# EAGLE design Daughter_Board (EAGLE 8.4.0)
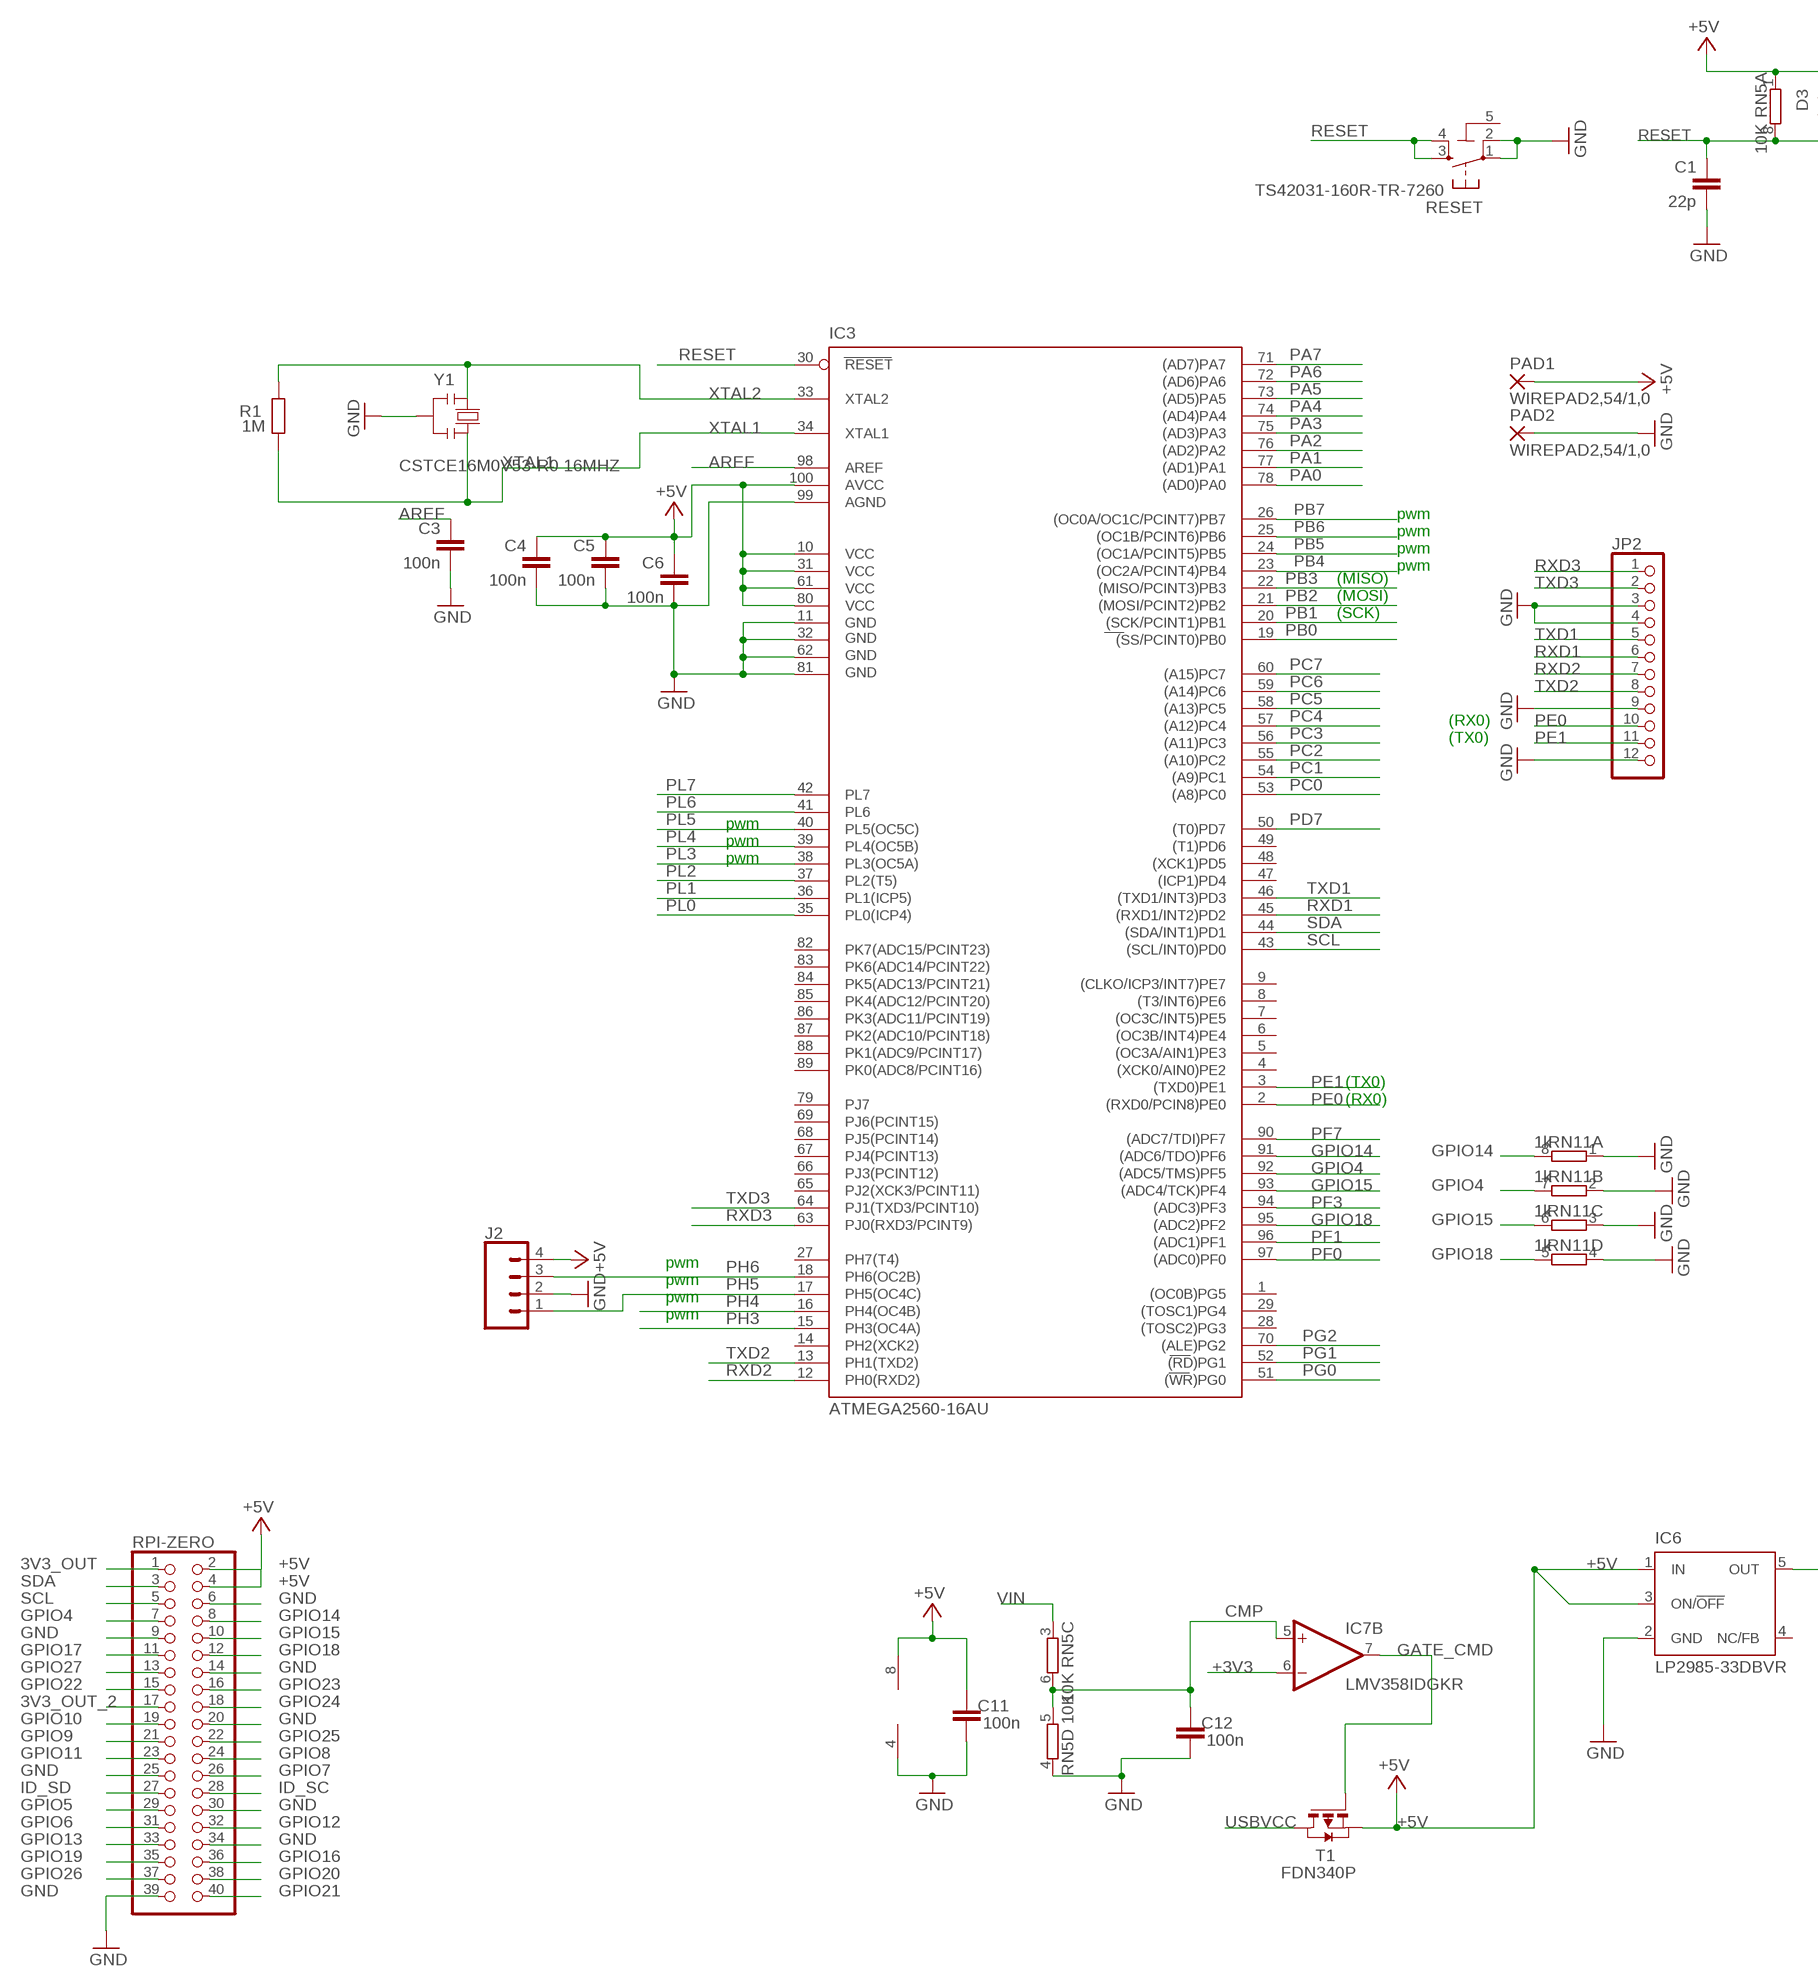
[diagram p0: schematic, sheet 1, part 1 of 2]
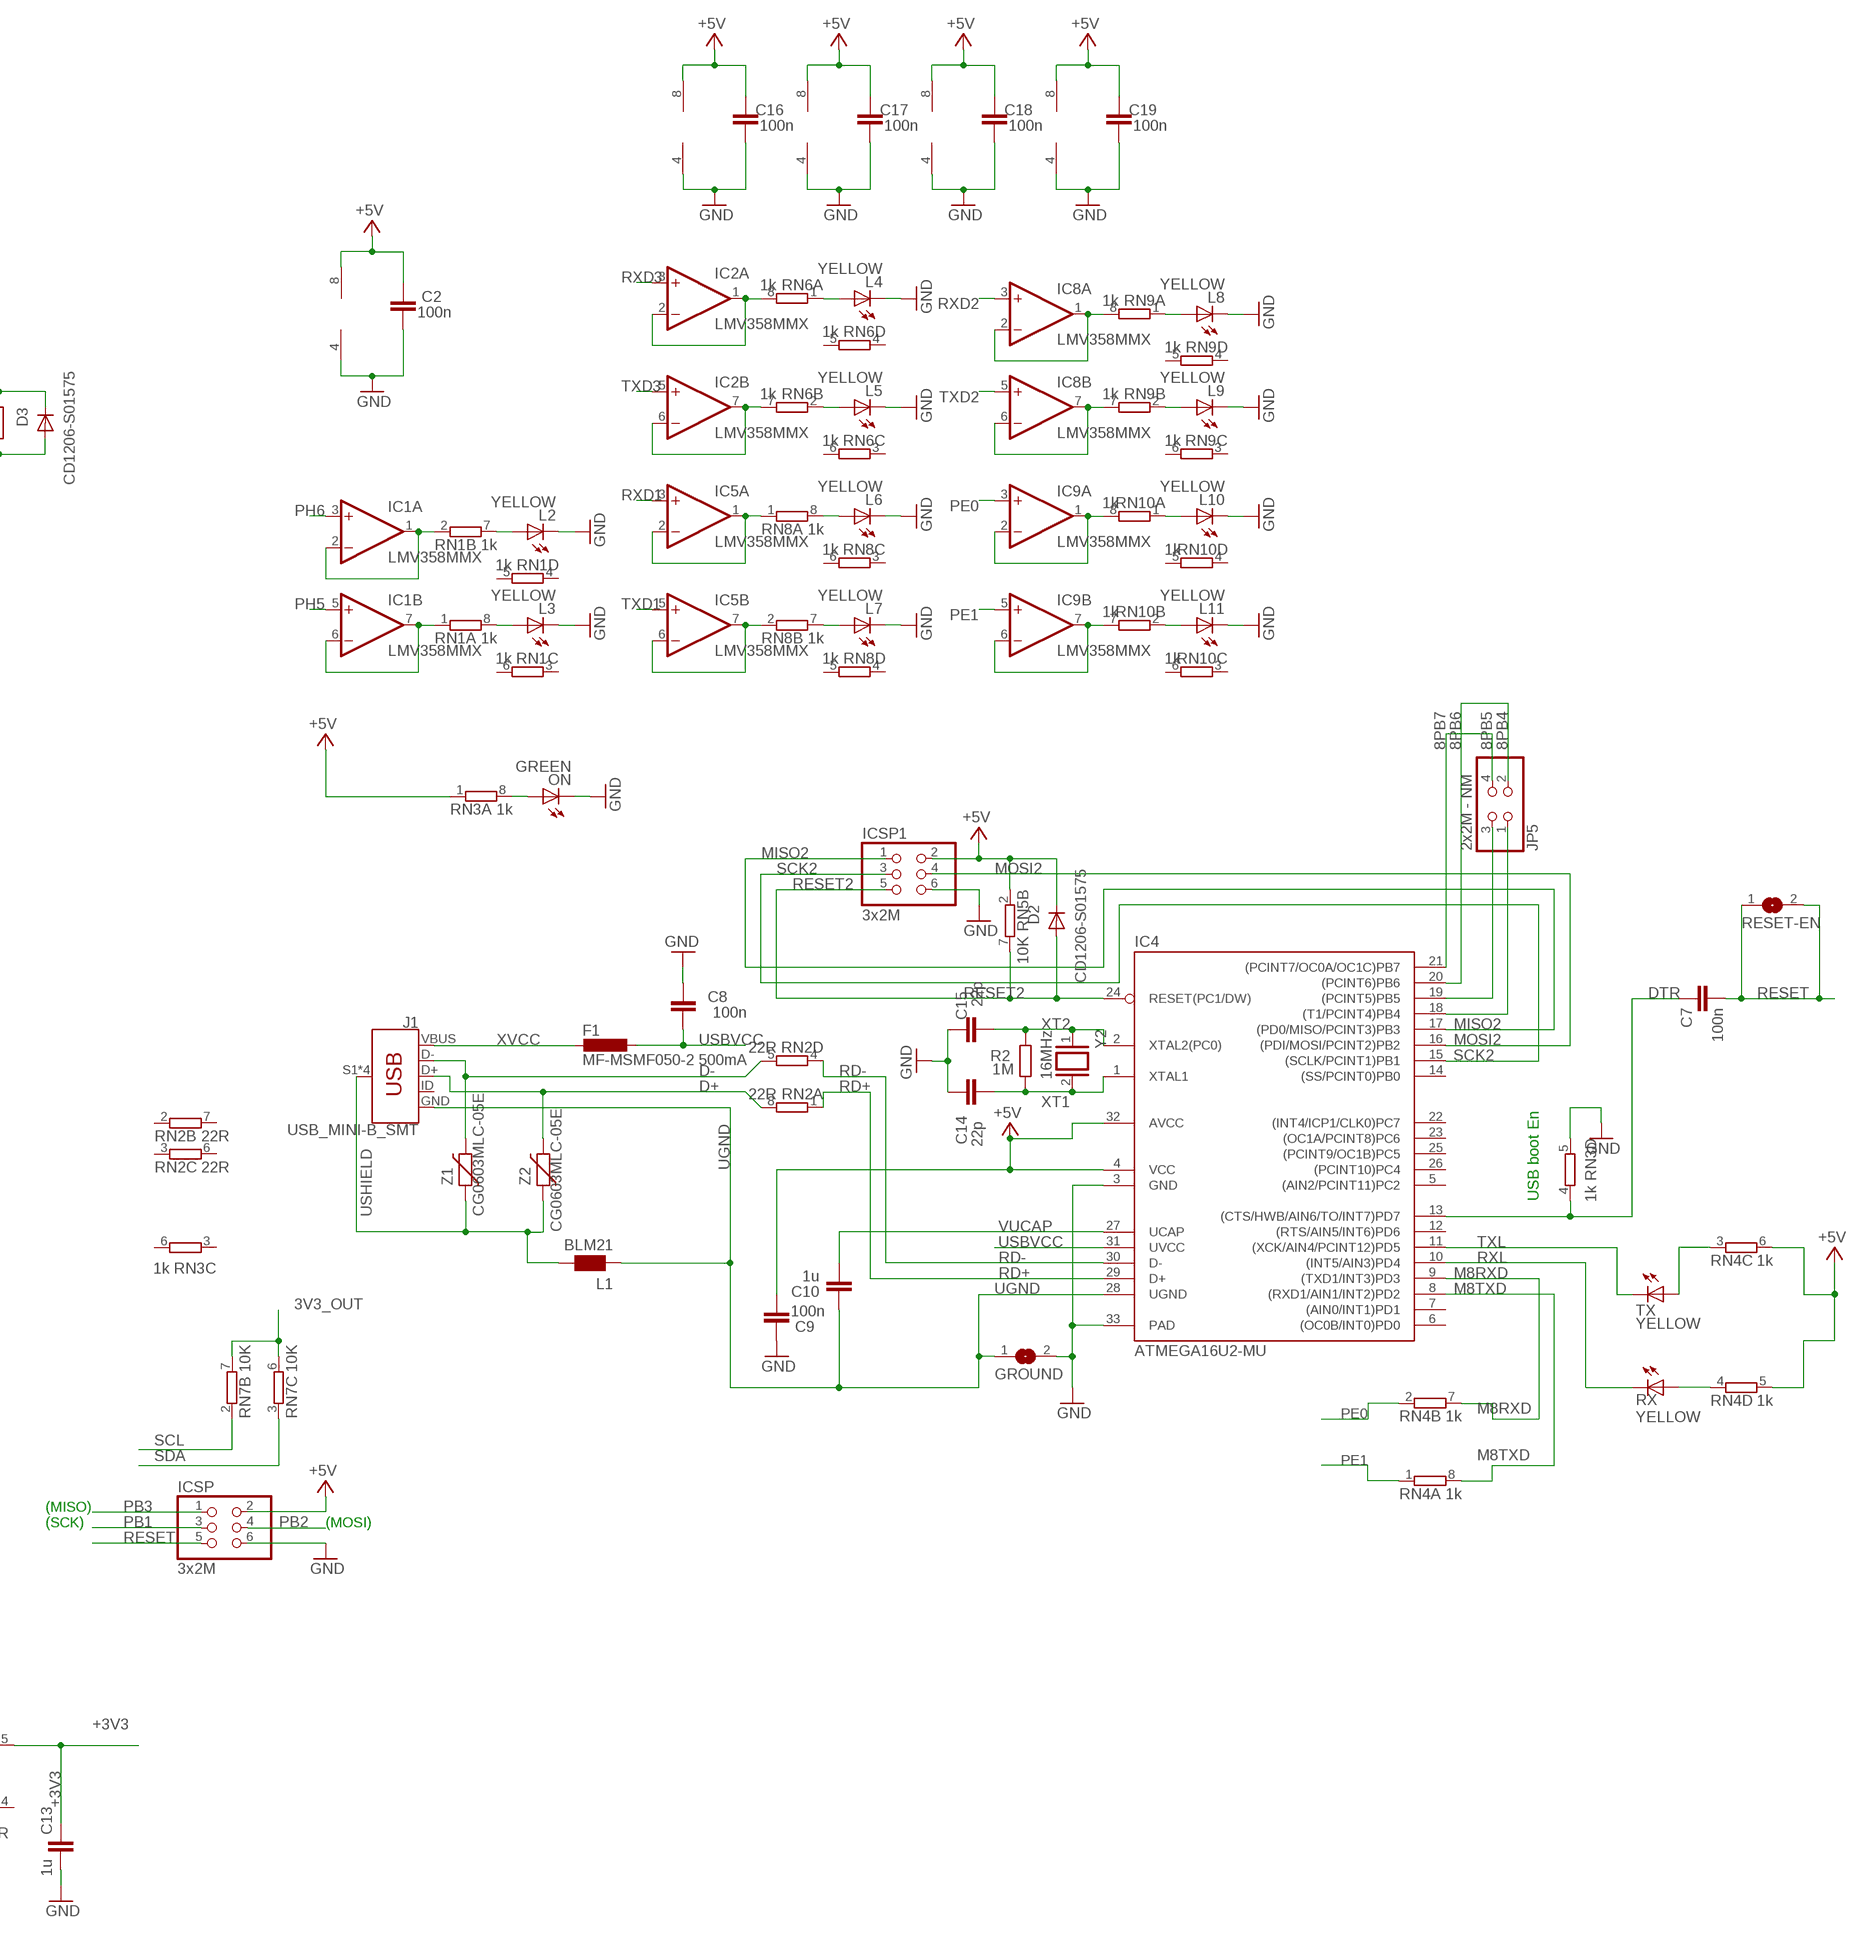
[diagram p1: schematic, sheet 1, part 2 of 2]

## Parts
C1  22p  C-EU0603-RND  [C0603-ROUND]
C2  100n  C-EU0603-RND  [C0603-ROUND]
C3  100n  C-EU0603-RND  [C0603-ROUND]
C4  100n  C-EU0603-RND  [C0603-ROUND]
C5  100n  C-EU0603-RND  [C0603-ROUND]
C6  100n  C-EU0603-RND  [C0603-ROUND]
C7  100n  C-EU0603-RND  [C0603-ROUND]
C8  100n  C-EU0603-RND  [C0603-ROUND]
C9  100n  C-EU0603-RND  [C0603-ROUND]
C10  1u  C-EU0603-RND  [C0603-ROUND]
C11  100n  C-EU0603-RND  [C0603-ROUND]
C12  100n  C-EU0603-RND  [C0603-ROUND]
C13  1u  C-EU0603-RND  [C0603-ROUND]
C14  22p  C-EU0603-RND  [C0603-ROUND]
C15  22p  C-EU0603-RND  [C0603-ROUND]
C16  100n  C-EU0603-RND  [C0603-ROUND]
C17  100n  C-EU0603-RND  [C0603-ROUND]
C18  100n  C-EU0603-RND  [C0603-ROUND]
C19  100n  C-EU0603-RND  [C0603-ROUND]
D2  CD1206-S01575  DIODE-MINIMELF  [MINIMELF]
D3  CD1206-S01575  DIODE-MINIMELF  [MINIMELF]
F1  MF-MSMF050-2 500mA  L-EUL1812  [L1812]
GROUND  SJ  [SJ]
IC1  LMV358MMX  [MSOP08]
IC2  LMV358MMX  [MSOP08]
IC3  ATMEGA2560-16AU  ATMEGA25602560-16AU  [TQFP100]
IC4  ATMEGA16U2-MU  [MLF32]
IC5  LMV358MMX  [MSOP08]
IC6  LP2985-33DBVR  LP2985-XXDBVR33  [SOT23-DBV]
IC7  LMV358IDGKR  LMV358MMX  [MSOP08]
IC8  LMV358MMX  [MSOP08]
IC9  LMV358MMX  [MSOP08]
ICSP  3x2M  PINHD-2X3  [2X03]
ICSP1  3x2M  PINHD-2X3  [2X03]
J1  USB_MINI-B_SMT  [USB-MINIB]
J2  CONN_04  [1X04]
JP2  PINHD-1X12-CB  [1X12-CB]
JP5  2x2M - NM  PINHD-2X2  [2X02]
L1  BLM21  WE-CBF_0805  [0805]
L2  YELLOW  LEDCHIP-LED0805  [CHIP-LED0805]
L3  YELLOW  LEDCHIP-LED0805  [CHIP-LED0805]
L4  YELLOW  LEDCHIP-LED0805  [CHIP-LED0805]
L5  YELLOW  LEDCHIP-LED0805  [CHIP-LED0805]
L6  YELLOW  LEDCHIP-LED0805  [CHIP-LED0805]
L7  YELLOW  LEDCHIP-LED0805  [CHIP-LED0805]
L8  YELLOW  LEDCHIP-LED0805  [CHIP-LED0805]
L9  YELLOW  LEDCHIP-LED0805  [CHIP-LED0805]
L10  YELLOW  LEDCHIP-LED0805  [CHIP-LED0805]
L11  YELLOW  LEDCHIP-LED0805  [CHIP-LED0805]
ON  GREEN  LEDCHIP-LED0805  [CHIP-LED0805]
PAD1  WIREPAD2,54/1,0  [2,54/1,0]
PAD2  WIREPAD2,54/1,0  [2,54/1,0]
R1  1M  R-EU_R0603  [R0603-ROUND]
R2  1M  R-EU_R0603  [R0603-ROUND]
RESET  TS42031-160R-TR-7260  TS42  [TS42]
RESET-EN  SJ  [SJ]
RN1  1k  4R-NCAY16  [CAY16]
RN2  22R  4R-NCAY16  [CAY16]
RN3  1k  4R-NCAY16  [CAY16]
RN4  1k  4R-NCAY16  [CAY16]
RN5  10K  4R-NCAT16  [CAT16]
RN6  1k  4R-NCAY16  [CAY16]
RN7  10K  4R-NCAT16  [CAT16]
RN8  1k  4R-NCAY16  [CAY16]
RN9  1k  4R-NCAY16  [CAY16]
RN10  1k  4R-NCAY16  [CAY16]
RN11  1k  4R-NCAY16  [CAY16]
RPI-ZERO  PINHD-2X20  [2X20]
RX  YELLOW  LEDCHIP-LED0805  [CHIP-LED0805]
T1  FDN340P  PMOSSOT23  [SOT-23]
TX  YELLOW  LEDCHIP-LED0805  [CHIP-LED0805]
Y1  CSTCE16M0V53-R0 16MHZ  RESONATORMU  [RESONATOR]
Y2  16MHz  XTAL/S  [QS]
Z1  CG0603MLC-05E  VARISTORCN0603  [CT/CN0603]
Z2  CG0603MLC-05E  VARISTORCN0603  [CT/CN0603]

## Nets
3V3_OUT: RN7.6 RN7.7 RPI-ZERO.1
3V3_OUT_2: RPI-ZERO.17
8PB4: IC4.18((T1/PCINT4)PB4) JP5.1
8PB5: IC4.19((PCINT5)PB5) JP5.3
8PB6: IC4.20((PCINT6)PB6) JP5.2
8PB7: IC4.21((PCINT7/OC0A/OC1C)PB7) JP5.4
+3V3 [power]: C13.2 IC6.5(OUT) IC7.6(B:-IN)
+5V [power usb]: C2.2 C4.1 C5.1 C6.1 C9.1 C11.2 C16.2 C17.2 C18.2 C19.2 D2.C D3.C IC1.8(P:V+) IC2.8(P:V+) IC3.10(VCC) IC3.31(VCC1) IC3.61(VCC2) IC3.80(VCC3) IC3.100(AVCC) IC4.4(VCC) IC4.32(AVCC) IC5.8(P:V+) IC6.1(IN) IC6.3(ON/!OFF) IC7.8(P:V+) IC8.8(P:V+) IC9.8(P:V+) ICSP1.2 ICSP.2 J2.4 PAD1.1(P) RN3.1 RN4.5 RN4.6 RN5.1 RN5.2 RPI-ZERO.2 RPI-ZERO.4 T1.2(S)
AREF: C3.1 IC3.98(AREF)
CMP: C12.2 IC7.5(B:+IN) RN5.5 RN5.6
D+: J1.D+ RN2.8 Z2.2
D-: J1.D- RN2.5 Z1.2
DTR: C7.1 IC4.13((CTS/HWB/AIN6/TO/INT7)PD7) RN3.4
GATE_CMD: IC7.7(B:OUT) T1.3(G)
GND: C1.2 C2.1 C3.2 C4.2 C5.2 C6.2 C8.2 C9.2 C11.1 C12.1 C13.1 C14.2 C15.2 C16.1 C17.1 C18.1 C19.1 GROUND.2 IC1.4(P:V-) IC2.4(P:V-) IC3.11(GND) IC3.32(GND1) IC3.62(GND2) IC3.81(GND3) IC3.99(AGND) IC4.3(GND) IC4.33(PAD) IC5.4(P:V-) IC6.2(GND) IC7.4(P:V-) IC8.4(P:V-) IC9.4(P:V-) ICSP1.6 ICSP.6 J2.2 JP2.3 JP2.4 JP2.9 JP2.12 L2.C L3.C L4.C L5.C L6.C L7.C L8.C L9.C L10.C L11.C ON.C PAD2.1(P) RESET.1 RESET.2 RN3.5 RN5.4 RN11.1 RN11.2 RN11.3 RN11.4 RPI-ZERO.6 RPI-ZERO.9 RPI-ZERO.14 RPI-ZERO.20 RPI-ZERO.25 RPI-ZERO.30 RPI-ZERO.34 RPI-ZERO.39 Y1.2
GPIO4: IC3.92((ADC5/TMS)PF5) RN11.7 RPI-ZERO.7
GPIO5: RPI-ZERO.29
GPIO6: RPI-ZERO.31
GPIO7: RPI-ZERO.26
GPIO8: RPI-ZERO.24
GPIO9: RPI-ZERO.21
GPIO10: RPI-ZERO.19
GPIO11: RPI-ZERO.23
GPIO12: RPI-ZERO.32
GPIO13: RPI-ZERO.33
GPIO14: IC3.91((ADC6/TDO)PF6) RN11.8 RPI-ZERO.8
GPIO15: IC3.93((ADC4/TCK)PF4) RN11.6 RPI-ZERO.10
GPIO16: RPI-ZERO.36
GPIO17: RPI-ZERO.11
GPIO18: IC3.95((ADC2)PF2) RN11.5 RPI-ZERO.12
GPIO19: RPI-ZERO.35
GPIO20: RPI-ZERO.38
GPIO21: RPI-ZERO.40
GPIO22: RPI-ZERO.15
GPIO23: RPI-ZERO.16
GPIO24: RPI-ZERO.18
GPIO25: RPI-ZERO.22
GPIO26: RPI-ZERO.37
GPIO27: RPI-ZERO.13
ID_SC: RPI-ZERO.28
ID_SD: RPI-ZERO.27
M8RXD: IC4.9((TXD1/INT3)PD3) RN4.7
M8TXD: IC4.8((RXD1/AIN1/INT2)PD2) RN4.8
MISO2: IC4.17((PD0/MISO/PCINT3)PB3) ICSP1.1
MOSI2: IC4.16((PDI/MOSI/PCINT2)PB2) ICSP1.4
N$1: L3.A RN1.8
N$2: L2.A RN1.7
N$3: ON.A RN3.8
N$4: IC1.1(A:OUT) IC1.2(A:-IN) RN1.2
N$5: IC5.6(B:-IN) IC5.7(B:OUT) RN8.2
N$6: IC1.6(B:-IN) IC1.7(B:OUT) RN1.1
N$7: IC5.1(A:OUT) IC5.2(A:-IN) RN8.1
N$8: IC2.6(B:-IN) IC2.7(B:OUT) RN6.7
N$9: IC2.1(A:OUT) IC2.2(A:-IN) RN6.8
N$10: L4.A RN6.1
N$11: L5.A RN6.2
N$12: IC8.1(A:OUT) IC8.2(A:-IN) RN9.8
N$13: L7.A RN8.7
N$14: L6.A RN8.8
N$15: IC8.6(B:-IN) IC8.7(B:OUT) RN9.7
N$16: IC9.1(A:OUT) IC9.2(A:-IN) RN10.8
N$17: IC9.6(B:-IN) IC9.7(B:OUT) RN10.7
N$18: L11.A RN10.2
N$19: L10.A RN10.1
N$21: L8.A RN9.1
N$22: L9.A RN9.2
N$54: RN4.4 RX.A
N$55: RN4.3 TX.A
PA0: IC3.78((AD0)PA0)
PA1: IC3.77((AD1)PA1)
PA2: IC3.76((AD2)PA2)
PA3: IC3.75((AD3)PA3)
PA4: IC3.74((AD4)PA4)
PA5: IC3.73((AD5)PA5)
PA6: IC3.72((AD6)PA6)
PA7: IC3.71((AD7)PA7)
PB0: IC3.19((SS/PCINT0)PB0)
PB1: IC3.20((SCK/PCINT1)PB1) ICSP.3
PB2: IC3.21((MOSI/PCINT2)PB2) ICSP.4
PB3: IC3.22((MISO/PCINT3)PB3) ICSP.1
PB4: IC3.23((OC2A/PCINT4)PB4)
PB5: IC3.24((OC1A/PCINT5)PB5)
PB6: IC3.25((OC1B/PCINT6)PB6)
PB7: IC3.26((OC0A/OC1C/PCINT7)PB7)
PC0: IC3.53((A8)PC0)
PC1: IC3.54((A9)PC1)
PC2: IC3.55((A10)PC2)
PC3: IC3.56((A11)PC3)
PC4: IC3.57((A12)PC4)
PC5: IC3.58((A13)PC5)
PC6: IC3.59((A14)PC6)
PC7: IC3.60((A15)PC7)
PD7: IC3.50((T0)PD7)
PE0: IC3.2((RXD0/PCIN8)PE0) IC9.3(A:+IN) JP2.10 RN4.2
PE1: IC3.3((TXD0)PE1) IC9.5(B:+IN) JP2.11 RN4.1
PF0: IC3.97((ADC0)PF0)
PF1: IC3.96((ADC1)PF1)
PF3: IC3.94((ADC3)PF3)
PF7: IC3.90((ADC7/TDI)PF7)
PG0: IC3.51((WR)PG0)
PG1: IC3.52((RD)PG1)
PG2: IC3.70((ALE)PG2)
PH3: IC3.15(PH3(OC4A))
PH4: IC3.16(PH4(OC4B))
PH5: IC1.5(B:+IN) IC3.17(PH5(OC4C)) J2.1
PH6: IC1.3(A:+IN) IC3.18(PH6(OC2B)) J2.3
PL0: IC3.35(PL0(ICP4))
PL1: IC3.36(PL1(ICP5))
PL2: IC3.37(PL2(T5))
PL3: IC3.38(PL3(OC5A))
PL4: IC3.39(PL4(OC5B))
PL5: IC3.40(PL5(OC5C))
PL6: IC3.41(PL6)
PL7: IC3.42(PL7)
RD+: IC4.29(D+) RN2.1
RD-: IC4.30(D-) RN2.4
RESET: C1.1 C7.2 D3.A IC3.30(RESET) ICSP.5 RESET-EN.1 RESET-EN.2 RESET.3 RESET.4 RN5.8
RESET2: D2.A IC4.24(RESET(PC1/DW)) ICSP1.5 RN5.7
RXD1: IC3.45((RXD1/INT2)PD2) IC5.3(A:+IN) JP2.6
RXD2: IC3.12(PH0(RXD2)) IC8.3(A:+IN) JP2.7
RXD3: IC2.3(A:+IN) IC3.63(PJ0(RXD3/PCINT9)) JP2.1
RXL: IC4.10((INT5/AIN3)PD4) RX.C
SCK2: IC4.15((SCLK/PCINT1)PB1) ICSP1.3
SCL: IC3.43((SCL/INT0)PD0) RN7.2 RPI-ZERO.5
SDA: IC3.44((SDA/INT1)PD1) RN7.3 RPI-ZERO.3
TXD1: IC3.46((TXD1/INT3)PD3) IC5.5(B:+IN) JP2.5
TXD2: IC3.13(PH1(TXD2)) IC8.5(B:+IN) JP2.8
TXD3: IC2.5(B:+IN) IC3.64(PJ1(TXD3/PCINT10)) JP2.2
TXL: IC4.11((XCK/AIN4/PCINT12)PD5) TX.C
UGND [gnd]: C10.2 GROUND.1 IC4.28(UGND) J1.GND L1.1
USBVCC [power usb]: C8.1 F1.1 IC4.31(UVCC) T1.1(D)
USHIELD [gnd]: J1.S1(SHIELD) J1.S2(SHIELD) J1.S3(SHIELD) J1.S4(SHIELD) L1.2 Z1.1 Z2.1
VIN [power]: RN5.3
VUCAP: C10.1 IC4.27(UCAP)
XT1: C14.1 IC4.1(XTAL1) R2.1 Y2.2
XT2: C15.1 IC4.2(XTAL2(PC0)) R2.2 Y2.1
XTAL1: IC3.34(XTAL1) R1.1 Y1.3
XTAL2: IC3.33(XTAL2) R1.2 Y1.1
XVCC [power usb]: F1.2 J1.VBUS
Unconnected: IC3.1((OC0B)PG5) IC3.4((XCK0/AIN0)PE2) IC3.5((OC3A/AIN1)PE3) IC3.6((OC3B/INT4)PE4) IC3.7((OC3C/INT5)PE5) IC3.8((T3/INT6)PE6) IC3.9((CLKO/ICP3/INT7)PE7) IC3.14(PH2(XCK2)) IC3.27(PH7(T4)) IC3.28((TOSC2)PG3) IC3.29((TOSC1)PG4) IC3.47((ICP1)PD4) IC3.48((XCK1)PD5) IC3.49((T1)PD6) IC3.65(PJ2(XCK3/PCINT11)) IC3.66(PJ3(PCINT12)) IC3.67(PJ4(PCINT13)) IC3.68(PJ5(PCINT14)) IC3.69(PJ6(PCINT15)) IC3.79(PJ7) IC3.82(PK7(ADC15/PCINT23)) IC3.83(PK6(ADC14/PCINT22)) IC3.84(PK5(ADC13/PCINT21)) IC3.85(PK4(ADC12/PCINT20)) IC3.86(PK3(ADC11/PCINT19)) IC3.87(PK2(ADC10/PCINT18)) IC3.88(PK1(ADC9/PCINT17)) IC3.89(PK0(ADC8/PCINT16)) IC4.5((AIN2/PCINT11)PC2) IC4.6((OC0B/INT0)PD0) IC4.7((AIN0/INT1)PD1) IC4.12((RTS/AIN5/INT6)PD6) IC4.14((SS/PCINT0)PB0) IC4.22((INT4/ICP1/CLK0)PC7) IC4.23((OC1A/PCINT8)PC6) IC4.25((PCINT9/OC1B)PC5) IC4.26((PCINT10)PC4) IC6.4(NC/FB) IC7.1(A:OUT) IC7.2(A:-IN) IC7.3(A:+IN) J1.ID RN1.3 RN1.4 RN1.5 RN1.6 RN2.2 RN2.3 RN2.6 RN2.7 RN3.2 RN3.3 RN3.6 RN3.7 RN6.3 RN6.4 RN6.5 RN6.6 RN7.1 RN7.4 RN7.5 RN7.8 RN8.3 RN8.4 RN8.5 RN8.6 RN9.3 RN9.4 RN9.5 RN9.6 RN10.3 RN10.4 RN10.5 RN10.6

## Notes on the sheet
- pwm
- pwm
- pwm
- pwm
- (MISO)
- (MOSI)
- (SCK)
- (RX0)
- (TX0)
- pwm
- pwm
- pwm
- USB boot En
- (TX0)
- (RX0)
- pwm
- pwm
- pwm
- (MISO)
- pwm
- (SCK) | (MOSI)

## Power pins joined to a net without a drawn wire
5-GND: RESET.5(5-GND)

## Library data of the parts
C1-C19 = SmartPrj:C-EU: CAPACITOR, European symbol
D2 D3 = diode:DIODE-: DIODE
F1 = rcl:L-EU: INDUCTOR, European symbol
GROUND RESET-EN = jumper:SJ: SMD solder JUMPER
IC1 IC2 IC5 IC7-IC9 = linear:LMV358?*: Dual General Purpose, Low Voltage, Rail-to-Rail Output Operational Amplifiers Source: http://www.national.com/mpf/LM/LMV321.html http://www.national.com/dt/lmv_qual.pdf
IC3 = SmartPrj:ATMEGA2560: MICROCONTROLLER 64/128/256 Kbytes FLASH 4 Kbytes EEPROM 8 Kbytes SRAM 86 General Purpose I/O pins 12-channels16-bit PWM 4 x Serial USARTs 16-channels 10-bit A/D
IC4 = SmartPrj:ATMEGA16U2-
IC6 = SmartPrj:LP2985-XXDBVR: ULTRALOW-POWER 50-mA LOW-DROPOUT LINEAR REGULATORS 50-mA Low-Dropout Regulator Source: http://focus.ti.com/lit/ds/symlink/tps77001.pdf
ICSP ICSP1 = SmartPrj:PINHD-2X3: PIN HEADER
J1 = SparkFun-Connectors:USB_MINI-B: USB type Mini-B Connector Breaks out 5th pin, and includes shield pins if needed. SparkFun Products: SparkFun FTDI Basic Breakout <https://www.sparkfun.com/products/9716> SparkFun XBee Explorer USB <https://www.sparkfun.com/products/11812> SparkFun Redboard <https://www.sparkfun.com/products/12757>; PROD_ID: CONN-08193; SF_ID: PRT-00587
J2 = SparkFun-Connectors:CONN_04: Multi connection point. Often used as Generic Header-pin footprint for 0.1 inch spaced/style header connections On any of the 0.1 inch spaced packages, you can populate with these: Break Away Headers - Straight <https://www.sparkfun.com/products/116> (PRT-00116) Break Away Male Headers - Right Angle <https://www.sparkfun.com/products/553> (PRT-00553) Female Headers <https://www.sparkfun.com/products/115> (PRT-00115) Break Away Headers - Machine Pin <https://www.sparkfun.com/products/117> (PRT-00117) Break Away Female Headers - Swiss Machine Pin <https://www.sparkfun.com/products/743> (PRT-00743) For SCREWTERMINALS and SPRING TERMINALS visit here: Screw Terimnals on SparkFun.com <https://www.sparkfun.com/search/results?term=Screw+Terminals> (5mm/3.5mm/2.54mm spacing) This device is also useful as a general connection point to wire up your design to another part of your project. Our various solder wires solder well into these plated through hole pads. Hook-Up Wire - Assortment (Stranded, 22 AWG) <https://www.sparkfun.com/products/11375> (PRT-11375) Hook-Up Wire - Assortment (Solid Core, 22 AWG) <https://www.sparkfun.com/products/11367> (PRT-11367) View the entire wire category on our website here <https://www.sparkfun.com/categories/141> Special notes: Molex polarized connector foot print use with SKU : PRT-08231 with associated crimp pins and housings. 1MM SMD Version SKU: PRT-10208; PROD_ID: CONN-09696
JP2 = adafruit:PINHD-1X12: PIN HEADER
JP5 = SmartPrj:PINHD-2X2: PIN HEADER
L1 = wuerth-elektronik:WE-CBF: SMD EMI Suppression Ferrite Beads - excellent anti-EMI properties - low DCR - impedances till 3000 ohms - rated current up to 6 A
L2-L11 ON RX TX = led:LED: LED OSRAM: - CHIPLED LG R971, LG N971, LY N971, LG Q971, LY Q971, LO R971, LY R971 LH N974, LH R974 LS Q976, LO Q976, LY Q976 LO Q996 - Hyper CHIPLED LW Q18S LB Q993, LB Q99A, LB R99A - SideLED LS A670, LO A670, LY A670, LG A670, LP A670 LB A673, LV A673, LT A673, LW A673 LH A674 LY A675 LS A676, LA A676, LO A676, LY A676, LW A676 LS A679, LY A679, LG A679 - Hyper Micro SIDELED® LS Y876, LA Y876, LO Y876, LY Y876 LT Y87S - SmartLED LW L88C, LW L88S LB L89C, LB L89S, LG L890 LS L89K, LO L89K, LY L89K LS L896, LA L896, LO L896, LY L896 - TOPLED LS T670, LO T670, LY T670, LG T670, LP T670 LSG T670, LSP T670, LSY T670, LOP T670, LYG T670 LG T671, LOG T671, LSG T671 LB T673, LV T673, LT T673, LW T673 LH T674 LS T676, LA T676, LO T676, LY T676, LB T676, LH T676, LSB T676, LW T676 LB T67C, LV T67C, LT T67C, LS T67K, LO T67K, LY T67K, LW E67C LS E67B, LA E67B, LO E67B, LY E67B, LB E67C, LV E67C, LT E67C LW T67C LS T679, LY T679, LG T679 LS T770, LO T770, LY T770, LG T770, LP T770 LB T773, LV T773, LT T773, LW T773 LH T774 LS E675, LA E675, LY E675, LS T675 LS T776, LA T776, LO T776, LY T776, LB T776 LHGB T686 LT T68C, LB T68C - Hyper Mini TOPLED® LB M676 - Mini TOPLED Santana® LG M470 LS M47K, LO M47K, LY M47K Source: http://www.osram.convergy.de LUXEON: - LUMILED® LXK2-PW12-R00, LXK2-PW12-S00, LXK2-PW14-U00, LXK2-PW14-V00 LXK2-PM12-R00, LXK2-PM12-S00, LXK2-PM14-U00 LXK2-PE12-Q00, LXK2-PE12-R00, LXK2-PE12-S00, LXK2-PE14-T00, LXK2-PE14-U00 LXK2-PB12-K00, LXK2-PB12-L00, LXK2-PB12-M00, LXK2-PB14-N00, LXK2-PB14-P00, LXK2-PB14-Q00 LXK2-PR12-L00, LXK2-PR12-M00, LXK2-PR14-Q00, LXK2-PR14-R00 LXK2-PD12-Q00, LXK2-PD12-R00, LXK2-PD12-S00 LXK2-PH12-R00, LXK2-PH12-S00 LXK2-PL12-P00, LXK2-PL12-Q00, LXK2-PL12-R00 Source: www.luxeon.com KINGBRIGHT: KA-3528ASYC Source: www.kingbright.com
PAD1 PAD2 = wirepad:WIREPAD: Wire PAD connect wire on PCB
R1 R2 = SmartPrj:R-EU_: RESISTOR, European symbol
RESET = SmartPrj:TS42: TS42 Dongnan Electronics Tact switch VDC 12V - 50mA
RN1-RN11 = resistor-dil:4R-N: Array Chip Resistor Source: RS Component / Phycomp
RPI-ZERO = pinhead:PINHD-2X20: PIN HEADER
T1 = zetex:PMOSSOT23: MOS FET
Y1 = SmartPrj:RESONATOR
Y2 = SmartPrj:XTAL/S: CRYSTAL
Z1 Z2 = varistor:VARISTOR: VARISTOR

## Net classes
0 default: width 0.203 mm, drill 0.406 mm, clearance 0.203 mm
1 power: width 0.61 mm, drill 0.406 mm, clearance 0.203 mm
2 gnd: width 0.305 mm, drill 0.406 mm, clearance 0.203 mm
3 power usb: width 0.508 mm, drill 0.406 mm, clearance 0.203 mm

## Board
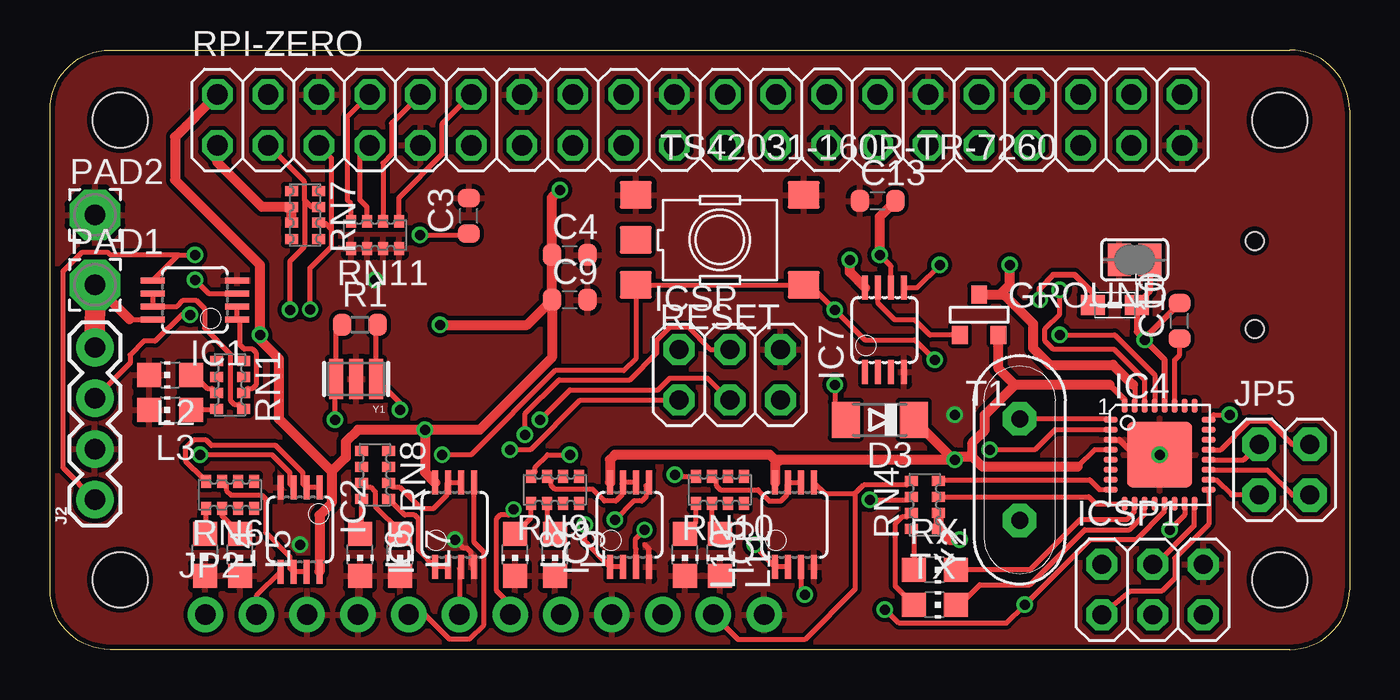
[diagram p2: board, top side]
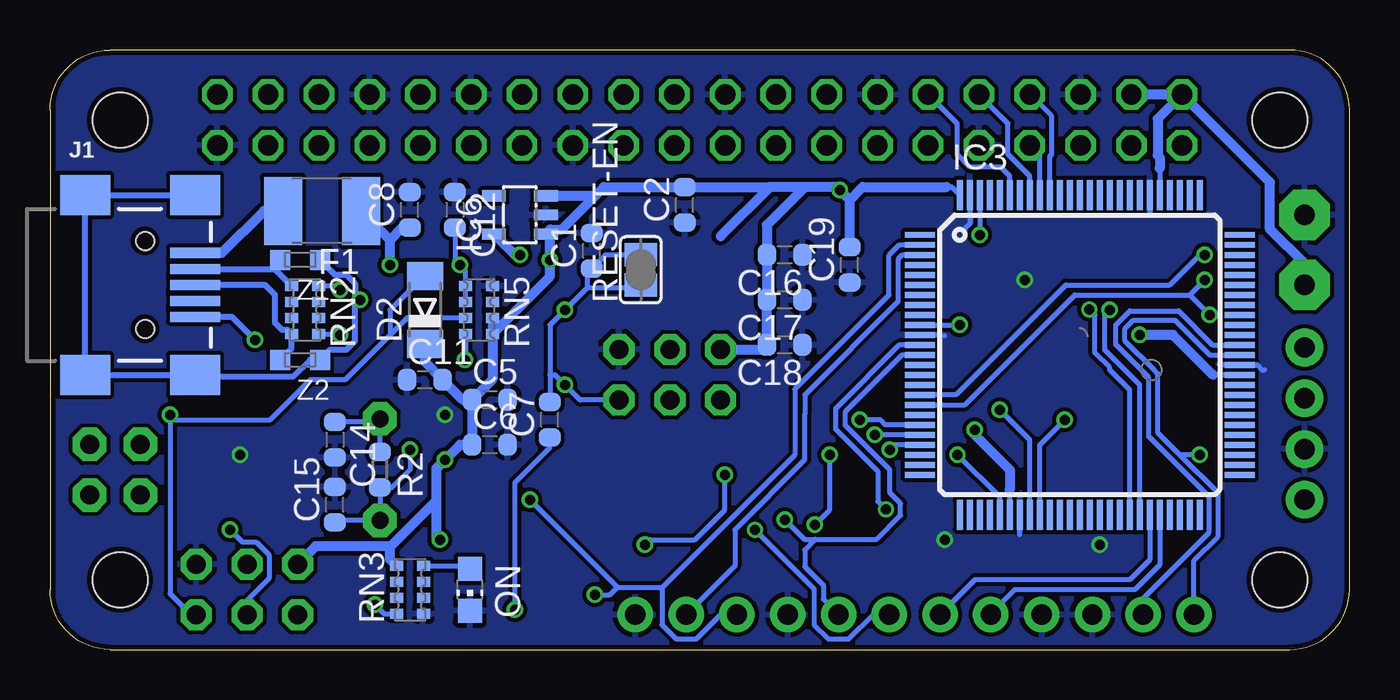
[diagram p3: board, bottom side, seen from below]

Size 65 x 30 mm. Coordinates in mm from the lower left corner, seen from the top.
Outline: 0,3 0,27 arc-90 3,30 62,30 arc-90 65,27 65,3 arc-90 62,0 3,0 arc-90 0,3
Copper layers (1*16): Top 0.035mm / dielectric 1.5mm / Bottom 0.035mm
Design rules "SeeedStudio_2layer_DRU_no_angle_20140221": minimum track width 6mil, minimum drill 12mil, track to track 6mil, track to pad 6mil, pad to pad 6mil, via to via 6mil, smd to smd 0mil, copper to edge 10mil, drill to drill 10mil, minimum pad ring 10mil, minimum via ring 6mil, stop-mask expansion 2mil, vias tented up to drill 100mil, thermal gap 10mil
Holes 2.75 mm at 3.5,3.5 3.5,26.5 61.5,26.5 61.5,3.5
tKeepout: area 0.8,23.8 to 6.2,29.2; area 0.8,0.8 to 6.2,6.2; area 58.8,0.8 to 64.2,6.2; area 58.8,23.8 to 64.2,29.2
bKeepout: area 0.8,23.8 to 6.2,29.2; area 0.8,0.8 to 6.2,6.2; area 58.8,0.8 to 64.2,6.2; area 58.8,23.8 to 64.2,29.2

### Footprints (pad centres in the part's own frame; a part is rotated, then mirrored left to right if it is on the bottom)
C0603-ROUND = smd 0.898 x 1.1: 1 -0.889,0; 2 0.889,0
MINIMELF = smd 1.4 x 1.8: A 1.7,0; C -1.7,0
L1812 = smd 1.9 x 3.4: 1 -1.95,0; 2 1.95,0
SJ = smd 1.168 x 1.6: 1 -0.762,0; 2 0.762,0
MSOP08 = smd 0.3 x 1.2: 1 -0.976,-2.113; 2 -0.326,-2.113; 3 0.324,-2.113; 4 0.974,-2.113; 5 0.974,2.112; 6 0.324,2.112; 7 -0.326,2.112; 8 -0.976,2.112
TQFP100 = smd 1.5 x 0.3: 1 -8,6; 2 -8,5.5; 3 -8,5; 4 -8,4.5; 5 -8,4; 6 -8,3.5; 7 -8,3; 8 -8,2.5; 9 -8,2; 10 -8,1.5; 11 -8,1; 12 -8,0.5; 13 -8,0; 14 -8,-0.5; 15 -8,-1; 16 -8,-1.5; 17 -8,-2; 18 -8,-2.5; 19 -8,-3; 20 -8,-3.5; 21 -8,-4; 22 -8,-4.5; 23 -8,-5; 24 -8,-5.5; 25 -8,-6; 51 8,-6; 52 8,-5.5; 53 8,-5; 54 8,-4.5; 55 8,-4; 56 8,-3.5; 57 8,-3; 58 8,-2.5; 59 8,-2; 60 8,-1.5; 61 8,-1; 62 8,-0.5; 63 8,0; 64 8,0.5; 65 8,1; 66 8,1.5; 67 8,2; 68 8,2.5; 69 8,3; 70 8,3.5; 71 8,4; 72 8,4.5; 73 8,5; 74 8,5.5; 75 8,6 | smd 0.3 x 1.5: 26 -6,-8; 27 -5.5,-8; 28 -5,-8; 29 -4.5,-8; 30 -4,-8; 31 -3.5,-8; 32 -3,-8; 33 -2.5,-8; 34 -2,-8; 35 -1.5,-8; 36 -1,-8; 37 -0.5,-8; 38 0,-8; 39 0.5,-8; 40 1,-8; 41 1.5,-8; 42 2,-8; 43 2.5,-8; 44 3,-8; 45 3.5,-8; 46 4,-8; 47 4.5,-8; 48 5,-8; 49 5.5,-8; 50 6,-8; 76 6,8; 77 5.5,8; 78 5,8; 79 4.5,8; 80 4,8; 81 3.5,8; 82 3,8; 83 2.5,8; 84 2,8; 85 1.5,8; 86 1,8; 87 0.5,8; 88 0,8; 89 -0.5,8; 90 -1,8; 91 -1.5,8; 92 -2,8; 93 -2.5,8; 94 -3,8; 95 -3.5,8; 96 -4,8; 97 -4.5,8; 98 -5,8; 99 -5.5,8; 100 -6,8
MLF32 = smd 0.7 x 0.28: 1 -2.45,1.75; 2 -2.45,1.25; 3 -2.45,0.75; 4 -2.45,0.25; 5 -2.45,-0.25; 6 -2.45,-0.75; 7 -2.45,-1.25; 8 -2.45,-1.75; 17 2.45,-1.75; 18 2.45,-1.25; 19 2.45,-0.75; 20 2.45,-0.25; 21 2.45,0.25; 22 2.45,0.75; 23 2.45,1.25; 24 2.45,1.75 | smd 0.28 x 0.7: 9 -1.75,-2.45; 10 -1.25,-2.45; 11 -0.75,-2.45; 12 -0.25,-2.45; 13 0.25,-2.45; 14 0.75,-2.45; 15 1.25,-2.45; 16 1.75,-2.45; 25 1.75,2.45; 26 1.25,2.45; 27 0.75,2.45; 28 0.25,2.45; 29 -0.25,2.45; 30 -0.75,2.45; 31 -1.25,2.45; 32 -1.75,2.45 | smd 3.254 x 3.254: 33 0,0
SOT23-DBV = smd 0.55 x 1.2: 1 -0.95,-1.3; 2 0,-1.3; 3 0.95,-1.3; 4 0.95,1.3; 5 -0.95,1.3
2X03 = drill 0.95 pad 1.55 octagon: 1 -2.54,-1.27; 2 -2.54,1.27; 3 0,-1.27; 4 0,1.27; 5 2.54,-1.27; 6 2.54,1.27
USB-MINIB = smd 2.5 x 0.5: D+ 2.5,0; D- 2.5,0.8; GND 2.5,-1.6; ID 2.5,-0.8; VBUS 2.5,1.6 | smd 2.5 x 2: S1 -3,4.5; S2 2.5,4.5; S3 -3,-4.5; S4 2.5,-4.5 | hole 0.9: 0,2.2; 0,-2.2
1X04 = drill 1.016 pad 1.88: 1 0,0; 2 2.54,0; 3 5.08,0; 4 7.62,0
1X12-CB = drill 1.016 pad 1.778: 1 -13.97,0; 2 -11.43,0; 3 -8.89,0; 4 -6.35,0; 5 -3.81,0; 6 -1.27,0; 7 1.27,0; 8 3.81,0; 9 6.35,0; 10 8.89,0; 11 11.43,0; 12 13.97,0
2X02 = drill 0.95 pad 1.676 octagon: 1 -1.27,-1.27; 2 -1.27,1.27; 3 1.27,-1.27; 4 1.27,1.27
0805 = smd 1.2 x 1: 1 -1.1,0; 2 1.1,0
CHIP-LED0805 = smd 1.2 x 1.2: A 0,-1.05; C 0,1.05
2,54/1,0 = drill 1.016 pad 2.54 octagon: 1 0,0
R0603-ROUND = smd 0.898 x 1.1: 1 -0.889,0; 2 0.889,0
TS42 = smd 1.6 x 1.4: 1 -4.2,2.25; 2 4.2,2.25; 3 -4.2,-2.25; 4 4.2,-2.25; 5 -4.2,0
CAY16 = smd 0.5 x 0.65: 1 -1.2,-0.675; 2 -0.4,-0.675; 3 0.4,-0.675; 4 1.2,-0.675; 5 1.2,0.675; 6 0.4,0.675; 7 -0.4,0.675; 8 -1.2,0.675
CAT16 = smd 0.5 x 0.65: 1 -1.2,-0.675; 2 -0.4,-0.675; 3 0.4,-0.675; 4 1.2,-0.675; 5 1.2,0.675; 6 0.4,0.675; 7 -0.4,0.675; 8 -1.2,0.675
2X20 = drill 1.016 octagon: 1 -24.13,-1.27; 2 -24.13,1.27; 3 -21.59,-1.27; 4 -21.59,1.27; 5 -19.05,-1.27; 6 -19.05,1.27; 7 -16.51,-1.27; 8 -16.51,1.27; 9 -13.97,-1.27; 10 -13.97,1.27; 11 -11.43,-1.27; 12 -11.43,1.27; 13 -8.89,-1.27; 14 -8.89,1.27; 15 -6.35,-1.27; 16 -6.35,1.27; 17 -3.81,-1.27; 18 -3.81,1.27; 19 -1.27,-1.27; 20 -1.27,1.27; 21 1.27,-1.27; 22 1.27,1.27; 23 3.81,-1.27; 24 3.81,1.27; 25 6.35,-1.27; 26 6.35,1.27; 27 8.89,-1.27; 28 8.89,1.27; 29 11.43,-1.27; 30 11.43,1.27; 31 13.97,-1.27; 32 13.97,1.27; 33 16.51,-1.27; 34 16.51,1.27; 35 19.05,-1.27; 36 19.05,1.27; 37 21.59,-1.27; 38 21.59,1.27; 39 24.13,-1.27; 40 24.13,1.27
SOT-23 = smd 0.787 x 0.889: 1 0.025,-1.016; 2 -0.94,1.016; 3 0.991,1.016
RESONATOR = smd 0.7 x 2: 1 -1,0; 2 0,0; 3 1,0
QS = drill 0.85 pad 1.676 octagon: 1 -2.54,0; 2 2.54,0
CT/CN0603 = smd 1 x 1: 1 -1,0; 2 1,0

### Placement (x,y rotation side)
C1  37.9,19.95 90 bottom
C2  33.25,22.25 90 bottom
C3  20.95,21.7 90 top
C4  26,19.75 0 top
C5  43,12.5 0 bottom
C6  43,10.25 0 bottom
C7  40,11.5 90 bottom
C8  47,22 90 bottom
C9  26,17.5 0 top
C10  56.5,16.45 90 top
C11  46.25,13.5 0 bottom
C12  44.75,22 270 bottom
C13  41.4,22.45 0 top
C14  50.75,10.5 270 bottom
C15  50.75,7.25 90 bottom
C16  28.25,19.75 180 bottom
C17  28.25,17.5 180 bottom
C18  28.25,15.25 180 bottom
C19  25,19.25 90 bottom
D2  46.25,17 90 bottom
D3  41.5,11.5 180 top
F1  51.4,21.95 180 bottom
GROUND  54.25,19.5 180 top
IC1  7.25,17.5 90 top
IC2  12.5,6 180 top
IC3  13.5,14.75 0 bottom
IC4  55.5,9.75 0 top
IC5  20.25,6.25 0 top
IC6  41.5,21.75 90 bottom
IC7  41.75,16 0 top
IC8  29,6.25 0 top
IC9  37.25,6.25 0 top
ICSP  34,13.75 0 top
ICSP1  55.15,3 0 top
J1  60.25,18.25 0 bottom
J2  2.25,7.49 90 top
JP2  21.75,1.75 0 top
JP5  61.75,9 0 top
L1  53.25,17.25 180 top
L2  6,13.75 90 top
L3  6,12 90 top
L4  7.75,4.75 180 top
L5  9.5,4.75 180 top
L6  15.5,4.75 180 top
L7  17.5,4.75 180 top
L8  23.25,4.75 180 top
L9  25.25,4.75 180 top
L10  31.75,4.75 180 top
L11  33.5,4.75 180 top
ON  44,3 180 bottom
PAD1  2.25,18.25 0 top
PAD2  2.25,21.75 0 top
R1  15.5,16.25 0 top
R2  48.5,9 270 bottom
RESET  33.5,20.5 0 top
RESET-EN  35.45,19 90 bottom
RN1  9,13.25 90 top
RN2  52.25,17 90 bottom
RN3  47,3 270 bottom
RN4  43.75,7.25 270 top
RN5  43.55,17 90 bottom
RN6  9,7.75 0 top
RN7  12.75,21.75 90 top
RN8  16.25,8.75 90 top
RN9  25.25,8 0 top
RN10  33.5,8 0 top
RN11  16.25,20.75 0 top
RPI-ZERO  32.5,26.5 0 top
RX  44.25,4 270 top
T1  46.5,16.75 180 top
TX  44.25,2.25 270 top
Y1  15.3,13.55 180 top
Y2  48.5,9 90 top
Z1  52.5,19.5 180 bottom
Z2  52.5,14.5 180 bottom

### Tracks (layer width: path | path; a pad name or v marks a point on that pad's centre or on a via)
3V3_OUT
  Top 0.508: RN7.7 RN7.6 10.6,22.15 8.37,24.38 RPI-ZERO.1
8PB4
  Top 0.254: IC4.18 57.98,8.47 58.37,8.47 59.11,7.73 JP5.1
8PB5
  Top 0.254: IC4.19 57.98,8.97 60.89,8.97 62.13,7.73 JP5.3
8PB6
  Top 0.254: IC4.20 59.71,9.5 JP5.2
8PB7
  Top 0.254: IC4.21 58.56,10 60,11.44 60.96,11.44 62.13,10.27 JP5.4
+3V3  (via drill 0.5)
  Top 0.254: IC7.6 42.07,19.18 v41.5,19.75
  Top 0.508: C13.2 41.5,21.66 v41.5,19.75
  Bottom 0.508: v41.5,19.75 41.75,19.75 IC6.5
+5V  (via drill 0.5)
  Top 0.254: IC4.4 52.25,10 51.39,9.14 | 3.98,16.52 IC1.8
  Top 0.305: IC4.32 53.75,12.5 53,13.25
  Top 0.508: 48.25,13.25 46.75,11.75 46.75,10.97 46.14,10.36 46.14,9.64 | 53,13.25 48.25,13.25 | 46.14,9.64 46.64,9.14 51.39,9.14 | 46.14,9.64 45.39,9.64 v45.25,9.5 | RN4.6 RN4.5 44.98,5.5 v45.5,5.5 | T1.2 47.44,14.06 48.25,13.25 | D3.C 45.2,9.5 v45.25,9.5 | 3.98,16.52 PAD1.1 | 14.08,8.9 14.08,7.32 13.48,6.72 IC2.8 | 14.08,8.9 11.46,11.53 11.46,14.54 10.5,15.49 v10.5,15.75 10.5,19.25 6.25,23.5 6.25,25.65 RPI-ZERO.2 | v18.75,11 18.75,8.89 IC5.8 | 36.5,9.5 36.27,9.27 IC9.8 | v45.25,9.5 36.5,9.5 | 36.5,9.5 36.25,9.5 36,9.75 28.25,9.75 28,9.5 28,8.39 IC8.8 | 14.08,8.9 14.79,9.61 14.79,10.39 15.4,11 v18.75,11 | C9.1 C4.1 25.11,22.61 v25.5,23 | C9.1 25.11,14.62 21.49,11 v18.75,11 | v19.5,16.25 23.86,16.25 C9.1 | v40,19.5 40,18.89 IC7.8
  Top 1.016: PAD1.1 J2.4
  Bottom 0.254: IC3.61 6.83,13.75 | IC3.31 17,8 | 20.14,23.14 19.89,23.14 IC3.100 | 9.5,24.08 IC3.80 | IC3.10 v19.5,16.25
  Bottom 0.508: 48,5.17 47.96,5.17 45.67,7.45 | 45.67,7.45 45.67,9.08 v45.25,9.5 44.5,10.25 C6.1 C5.1 | v45.5,5.5 45.67,5.67 45.67,7.45 | RN3.1 48,4.53 48,5.17 | D2.C 46.25,14.39 C11.2 44.36,12.5 C5.1 | RN5.2 RN5.1 | RN5.1 42.88,13.51 C5.1 | RN5.1 40,18.68 v40,19.5 40,20.6 IC6.1 39.98,21.02 39.41,21.02 37.71,22.71 | ICSP1.2 51.72,5.17 48,5.17 | RPI-ZERO.2 3.98,23.38 3.98,21.04 2.25,19.31 PAD1.1 | 6.83,13.75 8.83,15.75 v10.5,15.75 | 17,8 17,9 18.75,10.75 v18.75,11 | 29,23.14 C2.2 37.29,23.14 37.71,22.71 | 27.25,23.14 29,23.14 | 31.46,20.68 29,23.14 | C19.2 25,22.5 | 27.25,23.14 29.14,21.25 C16.2 C17.2 C18.2 29.37,15.02 ICSP.2 | RPI-ZERO.2 RPI-ZERO.4 | 9.5,24.08 9.5,24.64 9.59,24.73 9.59,26.55 RPI-ZERO.2 | IC6.3 40.19,22.71 37.71,22.71 | 27.25,23.14 25.64,23.14 v25.5,23 25,22.5 | 25,22.5 24.36,23.14 20.14,23.14
AREF  (via drill 0.5)
  Top 0.254: v18.5,20.75 20.89,20.75 C3.1
  Bottom 0.254: IC3.98 v18.5,20.75
CMP  (via drill 0.5)
  Top 0.254: IC7.5 43.36,18.11 v44.5,19.25
  Bottom 0.254: RN5.6 RN5.5 44.23,18.98 v44.5,19.25 44.75,19.5 C12.2
D+
  Bottom 0.305: Z2.2 52.92,15.07 RN2.8 53.12,15.99 53.4,15.99 53.75,16.35 53.75,17.75 54.25,18.25 J1.D+
D-
  Bottom 0.305: J1.D- 53.95,19.05 | 53.95,19.05 Z1.2 | 53.95,19.05 53.77,19.05 RN2.5
DTR  (via drill 0.5)
  Top 0.254: IC4.13 55.72,7.27 55.72,6.88 54.34,5.5 52,5.5 v48.75,2.25 47.82,1.32 43.94,1.32 42.46,1.32 41.78,2 v41.75,2
  Bottom 0.254: v48.75,2.25 48.3,1.8 RN3.4 | v41.75,2 41.75,8.36 40,10.11 C7.1
GATE_CMD
  Top 0.254: T1.3 44.02,15.73 43.25,16.5 42.25,16.5 41.42,17.33 IC7.7
GND  (via drill 0.5)
  Top 0.254: IC5.4 21.05,4.31 21.05,4.87 20.86,5.07 20.68,5.07 v20.25,5.5 | IC8.4 29.97,5.03 29.75,5.25
  Top 0.305: IC4.3 53.48,10.5 54.23,9.75 IC4.33
  Bottom 0.254: 45.39,11.75 v45.25,11.75 | RN5.4 42.88,18.38 | 4.25,14 4.38,14 4.61,14.23 5.48,14.23 IC3.62 6.5,14.25 | 16.5,5.75 IC3.32 | IC3.11 20.5,15.75 20.45,15.7 20.25,15.7 | 19.23,21.05 19,21.29 IC3.99 | IC3.81 10,21.75
  other vias: 55.5,9.75 12.5,5.25 16.25,18.5
  pour Bottom: 0,0 65,0 65,30 0,30
  pour Top: 0,0 65,0 65,30 0,30
GPIO4
  Top 0.254: RPI-ZERO.7 15.5,24.75 15.5,22.5 15.85,22.15 RN11.7
  Bottom 0.254: IC3.92 15.5,24.74 RPI-ZERO.7
GPIO14
  Top 0.254: RN11.8 15.05,22.3 14.9,22.46 14.9,26.68 RPI-ZERO.8
  Bottom 0.254: IC3.91 15,24.68 14.9,24.78 14.9,26.68 RPI-ZERO.8
GPIO15
  Top 0.254: RN11.6 16.65,24.34 17.08,24.78 17.08,26.33 17.25,26.5 17.26,26.5 RPI-ZERO.10
  Bottom 0.254: IC3.93 16,23.7 17.08,24.78 17.08,26.32 RPI-ZERO.10
GPIO18
  Top 0.254: RPI-ZERO.12 19.62,26.32 19.62,24.78 17.45,22.61 RN11.5
  Bottom 0.254: IC3.95 17,23.7 17.44,24.14 18.98,24.14 19.62,24.78 19.62,26.32 RPI-ZERO.12
M8RXD
  Top 0.254: RN4.7 51.95,7.65 52.3,7.3 IC4.9
M8TXD
  Top 0.254: IC4.8 52.5,8 52,8.5 44.48,8.5 RN4.8
MISO2
  Top 0.254: ICSP1.1 54.05,2.92 55.61,2.92 56.26,3.56 56.26,4.57 57.95,6.27 IC4.17
MOSI2
  Top 0.254: IC4.16 57.22,7.27 57.22,6.18 55.15,4.11 ICSP1.4
N$1
  Top 0.254: RN1.8 8.28,12 L3.A
N$2
  Top 0.254: RN1.7 8.11,13.07 7.86,13.07 7.18,13.75 L2.A
N$3
  Bottom 0.254: RN3.8 44.15,4.2 ON.A
N$4
  Top 0.254: RN1.2 9.89,13.07 10.14,13.07 10.33,13.26 10.33,14.84 10.14,15.03 9.72,15.03 9.5,15.25 9.5,16.39 IC1.1 IC1.2
N$5
  Top 0.254: IC5.6 IC5.7 19.86,8.3 19.86,7.73 19.19,7.06 18.56,7.06 17.48,8.13 17.14,8.13 RN8.2
N$6
  Top 0.254: IC1.6 IC1.7 6.36,17.17 6.67,17.48 7.3,17.48 7.73,17.05 7.73,16.08 9.02,14.8 9.02,12.46 9.21,12.27 9.46,12.27 RN1.1
N$7
  Top 0.254: IC5.2 IC5.1 18.43,4.98 18.43,6.54 18.24,6.73 17.75,6.73 RN8.1
N$8
  Top 0.254: IC2.7 IC2.6 12.01,4.06 12.01,4.62 10.78,5.85 10.78,7.54 10.59,7.73 9.05,7.73 8.82,7.96 8.82,8.21 RN6.7
N$9
  Top 0.254: IC2.1 IC2.2 12.66,8.28 12.66,8.85 11.3,10.21 8.08,10.21 7.8,10.48 7.2,10.48 6.77,10.05 6.77,9.45 7.2,9.02 7.21,9.02 RN6.8
N$10
  Top 0.254: L4.A 7.8,5.85 RN6.1
N$11
  Top 0.254: L5.A 8.6,6.7 RN6.2
N$12  (via drill 0.5)
  Top 0.254: IC8.2 IC8.1 26.75,5.41 v26.75,6.25 | RN9.8 24.27,8.89 24.27,9.14 24.88,9.75 v26,9.75
  Bottom 0.254: v26.75,6.25 26,7 v26,9.75
N$13
  Top 0.254: RN8.7 15.79,8.13 16.04,8.13 16.27,7.9 16.27,7.16 17.5,5.93 L7.A
N$14
  Top 0.254: L6.A 15.57,5.88 RN8.8
N$15
  Top 0.254: IC8.6 IC8.7 28.61,8.3 28.61,7.73 28.31,7.43 27.74,7.43 27.15,8.02 25.26,8.02 25.07,8.21 25.07,8.46 RN9.7
N$16  (via drill 0.5)
  Top 0.254: IC9.2 IC9.1 35.25,5.16 v35.25,5.25 | v31.25,8.75 31.32,8.68 RN10.8
  Bottom 0.254: v35.25,5.25 35,5.5 32.75,5.5 31.25,7 v31.25,8.75
N$17
  Top 0.254: RN10.7 33.32,8.46 33.32,8.21 33.53,8 35.42,8 35.99,7.43 36.56,7.43 36.86,7.73 36.86,8.22 37,8.36 | 37,8.36 IC9.7 | 37,8.36 IC9.6
N$18
  Top 0.254: L11.A 33.1,6.2 RN10.2
N$19
  Top 0.254: L10.A 32.3,6.35 RN10.1
N$21
  Top 0.254: L8.A 24.05,6.6 RN9.1
N$22
  Top 0.254: RN9.2 24.85,6.2 L9.A
N$54
  Top 0.254: RN4.4 43.2,5.92 RX.A
N$55
  Top 0.254: RN4.3 42.85,6.63 42.61,6.63 42.27,6.29 42.27,3.18 TX.A
PA7
  Bottom 0.254: IC3.71 5.52,18.73
PB1  (via drill 0.5)
  Top 0.254: v24.5,11.5 26,13 30.42,13 31,13.59 32.9,13.59 ICSP.3
  Bottom 0.254: IC3.20 23.21,11.25 23.45,11.48 24.48,11.48 v24.5,11.5
PB2  (via drill 0.5)
  Top 0.254: v23.75,10.75 23.77,10.77 23.77,11.8 25.46,13.5 29,13.5 30.36,14.86 30.36,15.48 31,16.12 31.92,16.12 33.02,15.02 ICSP.4
  Bottom 0.254: IC3.21 v23.75,10.75
PB3  (via drill 0.5)
  Top 0.254: v23,10 23.02,10.02 24.05,10.02 26.52,12.48 ICSP.1
  Bottom 0.254: IC3.22 22.75,10.25 v23,10
PE0  (via drill 0.5)
  Top 0.254: v41,7.5 42.92,7.5 RN4.2 | IC9.3 37.57,2.93 v37.75,2.75
  Bottom 0.254: IC3.2 21.52,20.23 22.53,20.23 23.04,19.73 23.04,17.75 27.75,13.04 27.75,9.75 34.38,3.12 | JP2.10 31.46,1.75 32.67,0.53 33.69,0.53 34.4,1.25 34.4,3.1 34.38,3.12 | 36.62,3.12 34.38,3.12 | 36.62,3.12 v41,7.5 | v37.75,2.75 37,2.75 36.62,3.12
PE1
  Top 0.254: 40.27,7.8 40.7,8.23 42.86,8.23 RN4.1 | 40.27,7.8 40.27,3.02 37.75,0.5 34.43,0.5 JP2.11 | IC9.5 38.78,7.8 40.27,7.8
  Bottom 0.254: IC3.3 21.52,19.73 22.39,19.73 22.58,19.54 22.58,17.42 27.25,12.75 27.25,11.79 27.25,9.5 30.75,6 30.75,4.18 JP2.11
PH5  (via drill 0.5)
  Top 0.254: IC1.5 6.41,19.75 | 6.41,19.75 v7.25,19.75 | 6.41,19.75 3.01,19.75 2.91,19.85 1.59,19.85 0.65,18.91 0.65,9.1 J2.1
  Bottom 0.254: IC3.17 21.48,12.77 19.66,12.77 14.18,18.25 9,18.25 7.5,19.75 v7.25,19.75
PH6  (via drill 0.5)
  Top 0.254: v7,16.75 6.58,16.75 5.26,15.43 4.68,15.43 4,14.75 4,14.32 J2.3 | v7.25,18.5 7.93,17.82 IC1.3
  Bottom 0.254: IC3.18 19.25,12.25 13.75,17.75 8,17.75 | 8,17.75 v7,16.75 | 8,17.75 v7.25,18.5
RD+  (via drill 0.5)
  Top 0.254: IC4.29 55.25,13.75 53.25,15.75 v50.5,15.75
  Bottom 0.254: RN2.1 50.55,15.8 v50.5,15.75
RD-  (via drill 0.5)
  Top 0.254: IC4.30 54.75,13.5 53.23,15.02 50.2,15.02 49.77,15.45 49.77,16.05 50.5,16.79 v50.5,18
  Bottom 0.254: v50.5,18 50.7,18.2 RN2.4
RESET  (via drill 0.5)
  Top 0.254: 39.75,11.5 39.5,11.5 | 39.75,11.5 D3.A | v39.25,13.25 39.25,12 39.75,11.5 | v19.61,9.75 21.07,9.75 25.27,13.96 28.71,13.96 29.3,14.55 RESET.3 RESET.4 38,18.25 v39.25,17 40.75,15.5 43.25,15.5 v44.25,14.5
  Bottom 0.254: RN5.8 44.23,14.53 v44.25,14.5 | 40,13.75 40,16.25 v39.25,17 38.15,18.1 | 40,13.75 C7.2 | 40,13.75 39.75,13.75 v39.25,13.25 38.48,12.48 ICSP.5 | RESET-EN.1 35.59,18.1 38.15,18.1 | RESET-EN.2 37.2,19.76 C1.1 38.15,18.81 38.15,18.1 | IC3.30 17.5,7.64 v19.61,9.75
RESET2  (via drill 0.5)
  Top 0.254: IC4.24 58.2,11.75 v59,11.75
  Bottom 0.254: 48,15.75 48,17 46.3,18.7 D2.A | RN5.7 47.15,16.6 48,15.75 | 48,15.75 50.25,13.5 52,13.5 54,11.5 58.75,11.5 v59,11.75 59,2.79 57.94,1.73 ICSP1.5
RXD1
  Top 0.254: IC5.3 20.48,4.04 JP2.6
  Bottom 0.254: IC3.45 10,4.5 11,3.5 18.73,3.5 JP2.6
RXD2  (via drill 0.5)
  Top 0.254: v23.19,7.01 22.92,6.73 22.51,6.73 22.32,6.54 22.32,2.96 23.02,2.26 JP2.7 | IC8.3 29.32,5.03 29.29,5.06 29.29,5.54 v29.73,5.98
  Bottom 0.254: IC3.12 21.52,15.23 22.53,15.23 25.69,12.07 25.69,11.01 23.59,8.91 23.59,7.4 v23.19,7.01 | v29.73,5.98 26.78,3.03 26.78,1.25 26.07,0.53 25.05,0.53 23.84,1.75 JP2.7
RXD3  (via drill 0.5)
  Top 0.254: IC2.3 12.01,8.28 12.01,8.85 11.11,9.75 v7.5,9.75
  Bottom 0.254: JP2.1 7.78,4.46 6.56,5.67 6.56,7.83 8.49,9.75 | 9.77,13.98 11.23,15.45 11.23,16.05 10.8,16.48 8.73,16.48 7,14.75 IC3.63 | 9.77,13.98 9.59,13.8 9.59,10.85 8.49,9.75 | 9.77,13.98 | v7.5,9.75 8.49,9.75
RXL
  Top 0.254: IC4.10 54.22,7.27 54.22,6.88 53.84,6.5 51.5,6.5 49,4 RX.C
SCK2  (via drill 0.5)
  Top 0.254: IC4.15 56.75,6.75 v56,6
  Bottom 0.254: ICSP1.3 55.15,2.46 54.05,3.56 54.05,4.73 54.69,5.38 55.38,5.38 v56,6
SCL  (via drill 0.5)
  Top 0.254: 14.08,21 14.08,24.6 RPI-ZERO.5 | RN7.2 13.73,21.35 14.08,21 | 14.08,21 14.08,20.16 13.01,19.09 v13.01,17.02
  Bottom 0.254: IC3.43 11,13 12,14 12,14.1 12.73,14.84 12.73,16.74 v13.01,17.02
SDA  (via drill 0.5)
  Top 0.254: v12,17 12,19.43 12.73,20.16 12.73,22.5 | 12.73,22.5 12.73,23.41 RPI-ZERO.3 | RN7.3 13.08,22.15 12.73,22.5
  Bottom 0.254: IC3.44 10.5,13.25 12.25,15 12.25,16.75 v12,17
TXD1
  Top 0.254: IC5.5 21.22,5.35 21.7,4.87 21.7,1.25 20.98,0.53 19.98,0.53 18.76,1.75 JP2.5
  Bottom 0.254: JP2.5 17.94,1.81 16.75,3 10.75,3 9.5,4.25 IC3.46
TXD2  (via drill 0.5)
  Top 0.254: IC8.5 29.8,8.19 29.8,7.62 29.61,7.43 29.18,7.43 v28.25,6.5
  Bottom 0.254: IC3.13 21.52,14.73 22.39,14.73 25.23,11.88 25.23,11.2 25.2,11.2 23,9 23,7.85 22.46,7.31 22.46,6.7 23.65,5.52 26.73,5.52 | JP2.8 26.32,2.51 26.32,3.22 27.25,4.15 27.25,5 26.73,5.52 | v28.25,6.5 27.27,5.52 26.73,5.52
TXD3
  Top 0.254: IC2.5 10.32,2.68 JP2.2
  Bottom 0.254: JP2.2 10.32,2.56 7.02,5.86 7.02,7.64 10.04,10.66 10.04,13.61 11.69,15.26 11.69,16.24 10.99,16.94 8.54,16.94 6.85,15.25 IC3.64
TXL
  Top 0.254: IC4.11 54.72,7.27 54.72,6.73 53.99,6 51.75,6 49,3.25 46.5,3.25 45.5,2.25 TX.C
UGND  (via drill 0.5)
  Top 0.305: IC4.28 55.75,14.5 v54.75,15.5 | v54.75,15.5 54.75,15.59 C10.2 | GROUND.1 55.01,17.91 L1.1 54.35,15.9 v54.75,15.5
  Bottom 0.305: v54.75,15.5 55.9,16.65 J1.GND
USBVCC  (via drill 0.5)
  Top 0.254: 54.17,13.25 54.25,13.17 IC4.31
  Top 0.508: 54.17,13.25 53.17,14.25 50,14.25 49.18,15.07 49.18,16.3 47.71,17.77 47.5,17.77 | T1.1 47.5,17.77 | 47.5,17.77 48,18.27 v48,19.25
  Bottom 0.508: v48,19.25 48,20.5 | 48,20.5 F1.1 | 48,20.5 47.39,21.11 C8.1
USHIELD  (via drill 0.5)
  Top 0.305: L1.2 52.15,17.85 51.24,18.76 50.19,18.76 49.5,18.07 v49.5,17.5
  Bottom 0.305: 49.74,18.31 50.19,18.76 | Z1.1 50.76,18.76 50.19,18.76 | J1.S2 J1.S1 J1.S3 J1.S4 56.36,13.64 52.85,13.64 51.99,14.5 Z2.1 51.01,14.99 50.19,14.99 49.74,15.44 49.74,17.26 v49.5,17.5 49.74,17.74 49.74,18.31 | 50.19,18.76 49.74,18.31
VUCAP
  Top 0.254: IC4.27 56.25,14.5 56.5,14.75 C10.1
XT1
  Top 0.254: IC4.1 53.01,11.54 Y2.2
  Bottom 0.254: 48.72,10.11 R2.1 Y2.2 48.65,11.39 C14.1
XT2  (via drill 0.5)
  Top 0.254: IC4.2 50.25,11 49.25,10 v47,10
  Bottom 0.254: v47,10 47,9 47.89,8.11 R2.2 Y2.1 50.65,6.46 C15.1
XTAL1  (via drill 0.5)
  Top 0.254: v14.25,11.5 14.25,13.5 Y1.3 14.3,15.94 R1.1
  Bottom 0.254: IC3.34 15.5,10.25 v14.25,11.5
XTAL2  (via drill 0.5)
  Top 0.254: v17.5,12 17.5,12.35 Y1.1 16.3,16.16 R1.2
  Bottom 0.254: IC3.33 16,10.5 v17.5,12
XVCC
  Bottom 0.508: J1.VBUS 56.4,19.85 54.3,21.95 F1.2